# EAGLE schematic sch (EAGLE 8.7.0)
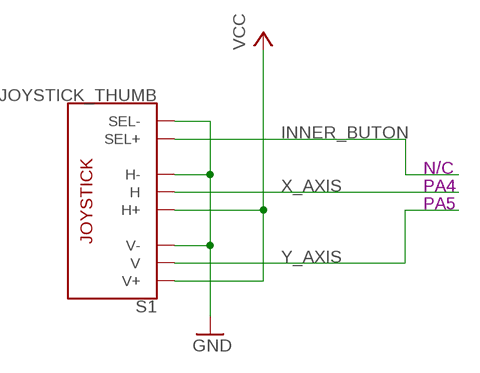
[diagram p0: schematic, sheet 1]

## Parts
S1  JOYSTICK_THUMB  [JOYSTICK]

## Nets
GND: S1.B2A(SEL-) S1.H3(H-) S1.V3(V-)
INNER_BUTON: S1.B1A(SEL+)
VCC: S1.H1(H+) S1.V1(V+)
X_AXIS: S1.H2(H)
Y_AXIS: S1.V2(V)

## Notes on the sheet
- N/C
- PA4
- PA5

## Library data of the parts
S1 = SparkFun-Switches:JOYSTICK_THUMB: Analog Thumb Joystick This is a joystick very similar to the ‘analog’ joysticks on PS2 (PlayStation 2) controllers. Directional movements are simply two potentiometers - one for each axis. Pots are ~10k each. This joystick also has a select button that is actuated when the joystick is pressed down. SparkFun Products Thumb Joystick <https://www.sparkfun.com/products/9032> (COM-09032) SparkFun Thumb Joystick Breakout <https://www.sparkfun.com/products/9110> (BOB-09110) SparkFun Joystick Shield Kit <https://www.sparkfun.com/products/9760> (DEV-09760); PROD_ID: COMP-09744; SF_SKU: COM-09032